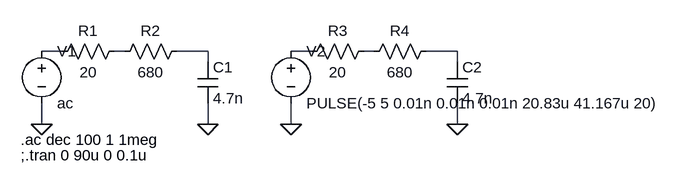
[diagram p0: schematic Filtro RC.asc]
Filtro RC.asc, the LTspice schematic file:
Version 4
SHEET 1 1036 680
WIRE 112 112 80 112
WIRE 208 112 192 112
WIRE 336 112 288 112
WIRE 496 112 464 112
WIRE 592 112 576 112
WIRE 720 112 672 112
WIRE 336 128 336 112
WIRE 720 128 720 112
WIRE 80 224 80 192
WIRE 336 224 336 192
WIRE 464 224 464 192
WIRE 720 224 720 192
FLAG 336 224 0
FLAG 80 224 0
FLAG 720 224 0
FLAG 464 224 0
SYMBOL res 208 96 R90
WINDOW 0 0 56 VBottom 2
WINDOW 3 32 56 VTop 2
SYMATTR InstName R1
SYMATTR Value 20
SYMBOL cap 320 128 R0
SYMATTR InstName C1
SYMATTR Value 4.7n
SYMBOL voltage 80 96 R0
WINDOW 123 0 0 Left 0
WINDOW 39 0 0 Left 0
SYMATTR InstName V1
SYMATTR Value ac
SYMBOL res 304 96 R90
WINDOW 0 0 56 VBottom 2
WINDOW 3 32 56 VTop 2
SYMATTR InstName R2
SYMATTR Value 680
SYMBOL res 592 96 R90
WINDOW 0 0 56 VBottom 2
WINDOW 3 32 56 VTop 2
SYMATTR InstName R3
SYMATTR Value 20
SYMBOL cap 704 128 R0
SYMATTR InstName C2
SYMATTR Value 4.7n
SYMBOL voltage 464 96 R0
WINDOW 123 0 0 Left 0
WINDOW 39 0 0 Left 0
SYMATTR InstName V2
SYMATTR Value PULSE(-5 5 0.01n 0.01n 0.01n 20.83u 41.167u 20)
SYMBOL res 688 96 R90
WINDOW 0 0 56 VBottom 2
WINDOW 3 32 56 VTop 2
SYMATTR InstName R4
SYMATTR Value 680
TEXT 48 248 Left 2 !.ac dec 100 1 1meg
TEXT 48 272 Left 2 !;.tran 0 90u 0 0.1u

The netlist it stands for:
* Filtro RC.asc
R1 N002 N001 20
C1 N003 0 4.7n
V1 N001 0 ac
R2 N003 N002 680
R3 N005 N004 20
C2 N006 0 4.7n
V2 N004 0 PULSE(-5 5 0.01n 0.01n 0.01n 20.83u 41.167u 20)
R4 N006 N005 680
.ac dec 100 1 1meg
;.tran 0 90u 0 0.1u
.backanno
.end